# EAGLE design Dualpower Supply (EAGLE 9.6.2)
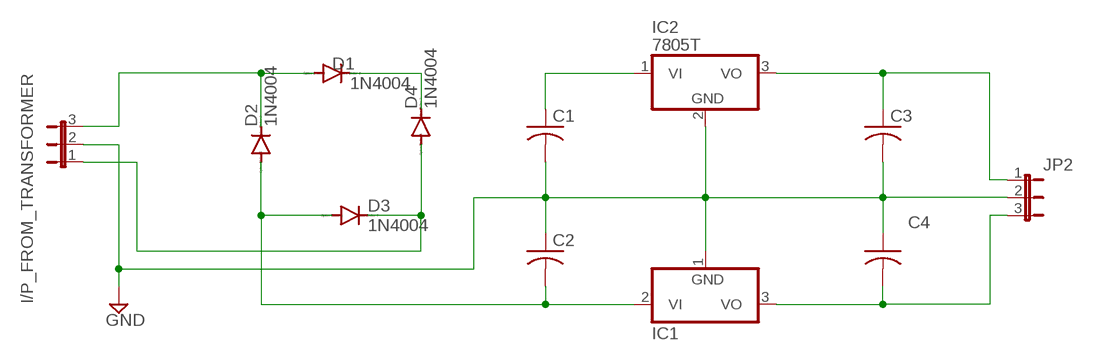
[diagram p0: schematic, sheet 1]

## Parts
C1  C-US025-024X044  [C025-024X044]
C2  C-US025-024X044  [C025-024X044]
C3  C-US025-024X044  [C025-024X044]
C4  C-US025-024X044  [C025-024X044]
D1  1N4004  [DO41-10]
D2  1N4004  [DO41-10]
D3  1N4004  [DO41-10]
D4  1N4004  [DO41-10]
I/P_FROM_TRANSFORMER  JP2E  [JP2]
IC1  7905T  [TO220H]
IC2  7805T  [TO220H]
JP2  JP2E  [JP2]

## Nets
GND: C1.2 C2.1 C3.2 C4.1 I/P_FROM_TRANSFORMER.2 IC1.1(GND) IC2.2(GND) JP2.2
N$1: D1.A D2.C I/P_FROM_TRANSFORMER.3
N$2: D1.C D4.C
N$3: D3.C D4.A I/P_FROM_TRANSFORMER.1
N$4: C2.2 D2.A D3.A IC1.2(VI)
N$6: C1.1 IC2.1(VI)
N$7: C3.1 IC2.3(VO) JP2.1
N$8: C4.2 IC1.3(VO) JP2.3

## Library data of the parts
C1-C4 = rcl:C-US: CAPACITOR, American symbol; SPICEPREFIX: C
D1-D4 = diode:1N4004: DIODE general purpose rectifier, 1 A
I/P_FROM_TRANSFORMER JP2 = jumper:JP2E: JUMPER
IC1 = linear:79*: Negative VOLTAGE REGULATOR
IC2 = linear:78*: Positive VOLTAGE REGULATOR Source: http://cache.national.com/ds/LM/LM78L05.pdf http://www.fairchildsemi.com/ds/LM/LM7805.pdf

## Board
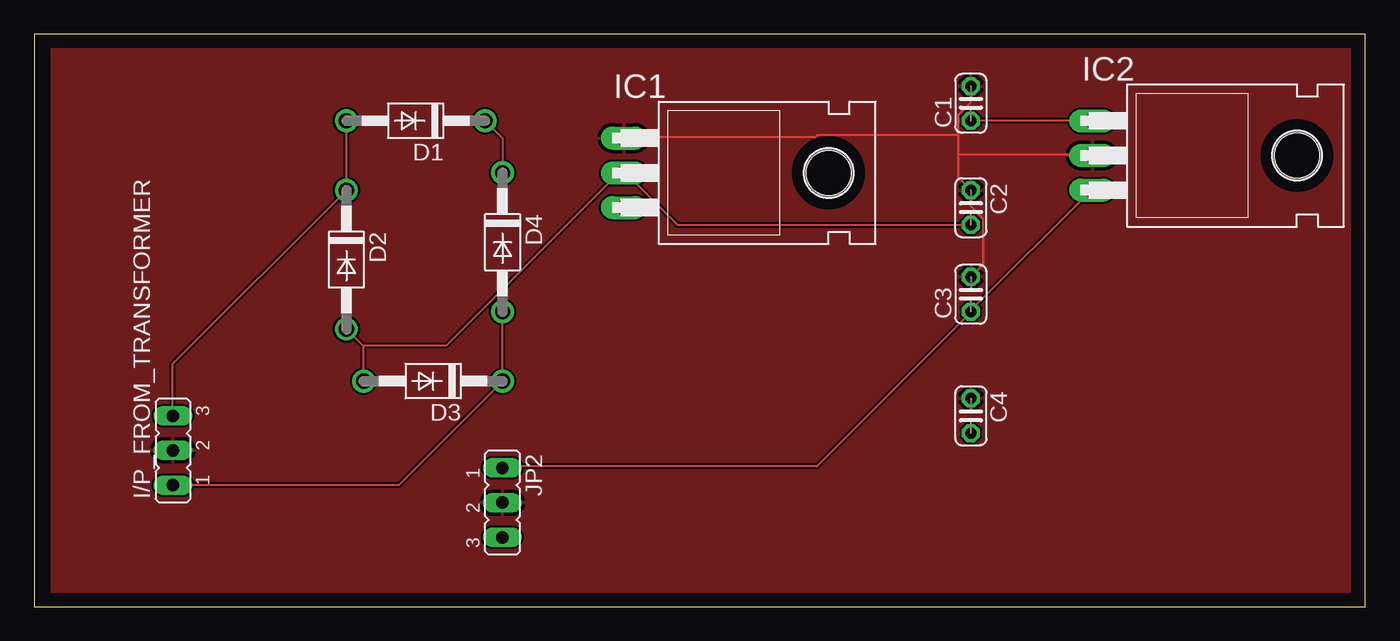
[diagram p1: board, top side]
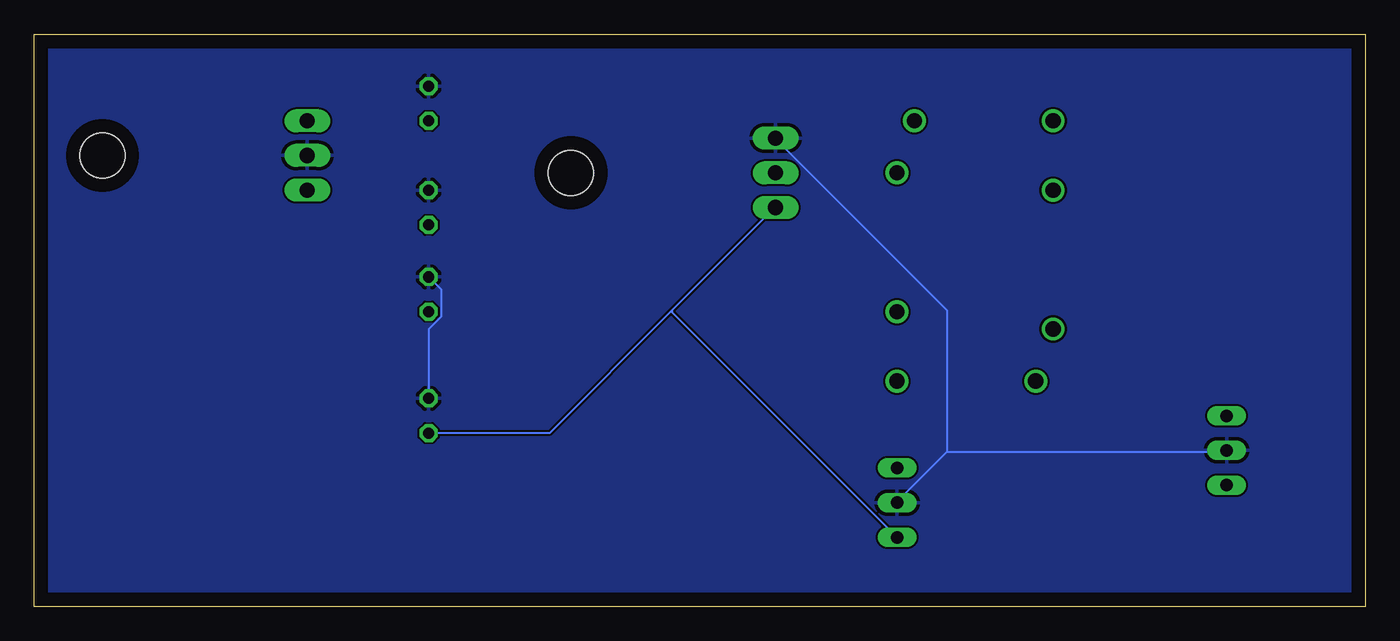
[diagram p2: board, bottom side, seen from below]

Size 97.46 x 41.9 mm. Coordinates in mm from the lower left corner, seen from the top.
Outline: 0,0 97.46,0 97.46,41.9 0,41.9 0,0
Copper layers (1*16): Top 0.035mm / dielectric 1.5mm / Bottom 0.035mm
Design rules "default": minimum track width 6mil, minimum drill 0.35mm, track to track 6mil, track to pad 6mil, pad to pad 6mil, via to via 6mil, smd to smd 6mil, copper to edge 40mil, drill to drill 6mil, minimum pad ring 10mil, minimum via ring 8mil, stop-mask expansion 4mil, vias tented up to drill 0mil, thermal gap 10mil

### Footprints (pad centres in the part's own frame; a part is rotated, then mirrored left to right if it is on the bottom)
C025-024X044 = drill 0.813 octagon: 1 -1.27,0; 2 1.27,0
DO41-10 = drill 1.118: A 5.08,0; C -5.08,0
JP2 = drill 0.914 long: 1 -2.54,0; 2 0,0; 3 2.54,0
TO220H = drill 1.118 long: 1 -2.54,-10.16; 2 0,-10.16; 3 2.54,-10.16 | hole 3.302: 0,4.826

### Placement (x,y rotation side)
C1  68.58,36.83 90 top
C2  68.58,29.21 270 top
C3  68.58,22.86 90 top
C4  68.58,13.97 270 top
D1  27.94,35.56 180 top
D2  22.86,25.4 270 top
D3  29.21,16.51 180 top
D4  34.29,26.67 270 top
I/P_FROM_TRANSFORMER  10.16,11.43 90 top
IC1  53.34,31.75 270 top
IC2  87.63,33.02 270 top
JP2  34.29,7.62 270 top
U$1  [1N4001]  66.04,-7.62 0 top  (outside the outline)

### Tracks (layer width: path | path; a pad name or v marks a point on that pad's centre or on a via)
GND
  Top 0.152: C3.2 69.49,25.04 69.49,28.4 68.58,29.31 C2.1 68.58,30.53 67.67,31.45 67.67,33.12 | C1.2 68.58,36.93 67.67,36.02 67.67,34.49 | 67.67,33.12 67.67,34.49 | 67.67,34.49 57.3,34.49 57.15,34.34 43.28,34.34 IC1.1 | 67.67,33.12 77.42,33.12 IC2.2
  Bottom 0.152: 30.63,11.33 10.21,11.33 I/P_FROM_TRANSFORMER.2 | 30.63,11.33 34.29,7.67 JP2.2 | C4.1 68.58,20.32 67.67,21.23 67.67,23.22 C3.2 | 30.63,11.33 30.63,21.69 43.13,34.19 IC1.1
  pour Top: 1.27,41.91 101.6,41.91 101.6,-1.27 1.27,-1.27
  pour Bottom: -1.27,43.18 102.87,43.18 102.87,-2.54 -1.27,-2.54
N$1
  Top 0.152: I/P_FROM_TRANSFORMER.3 10.16,17.78 D2.C D1.A
N$2
  Top 0.152: D1.C 34.29,34.29 D4.C
N$3
  Top 0.152: I/P_FROM_TRANSFORMER.1 26.67,8.89 D3.C D4.A
N$4
  Top 0.152: 24.08,19.1 24.08,16.51 D3.A | D2.A 24.08,19.1 | C2.2 47.09,27.94 43.28,31.75 IC1.2 42.82,31.75 30.17,19.1 24.08,19.1
N$6
  Top 0.152: IC2.1 C1.1
N$7
  Top 0.152: IC2.3 77.42,30.53 68.58,21.69 C3.1 68.58,21.54 57.3,10.26 34.29,10.26 JP2.1
N$8
  Bottom 0.152: C4.2 59.74,12.7 50.75,21.69 | 50.75,21.69 43.28,29.16 IC1.3 | JP2.3 50.75,21.54 50.75,21.69